# Altium schematic sheet ALU_Add_Shift.SchDoc
size B; Author: E. Sims; Organization: Let's Build Rockets Inc.; SheetNumber: 1; SheetTotal: 3
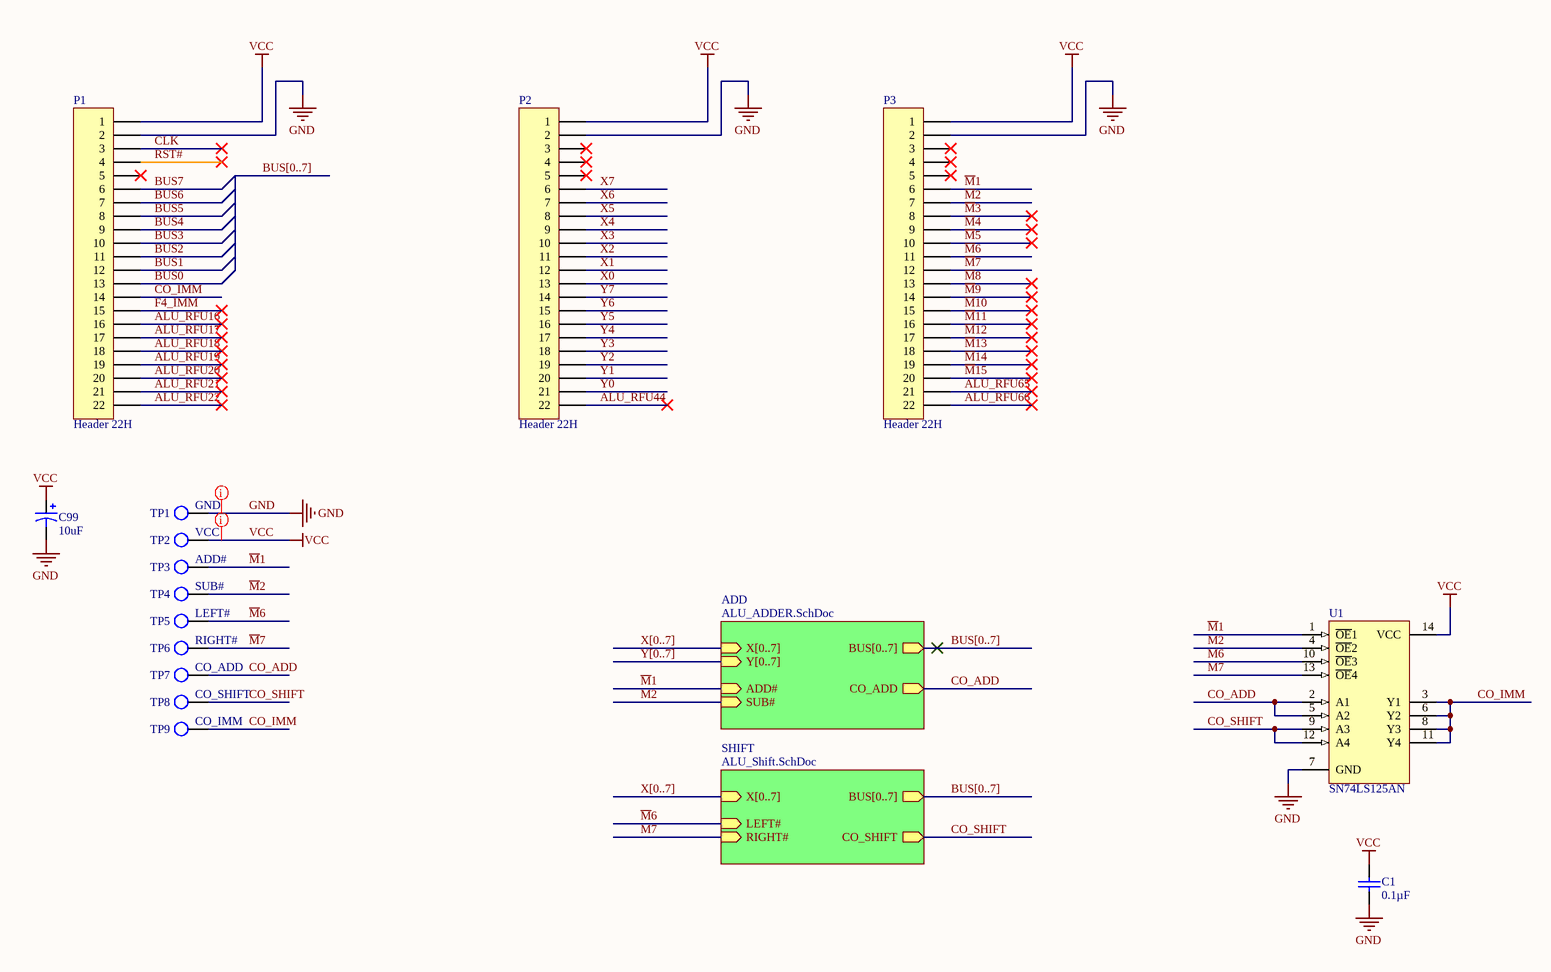
[diagram p0: ALU_Add_Shift.SchDoc]

## Parts
C1  Capacitance: 0.1µF  [VISH-K104K15X7RF5TL2]  (hidden comment: K104K15X7RF5TL2)
C99  value 10uF  [C5x7]  (hidden comment: Cap Pol5)
P1  Header 22H  [HDR1X22H]
P2  Header 22H  [HDR1X22H]
P3  Header 22H  [HDR1X22H]
TP1  GND  [KSTN-5011_V]  (no BOM)
TP2  VCC  [KSTN-5011_V]  (no BOM)
TP3  ADD#  [KSTN-5011_V]  (no BOM)
TP4  SUB#  [KSTN-5011_V]  (no BOM)
TP5  LEFT#  [KSTN-5011_V]  (no BOM)
TP6  RIGHT#  [KSTN-5011_V]  (no BOM)
TP7  CO_ADD  [KSTN-5011_V]  (no BOM)
TP8  CO_SHIFT  [KSTN-5011_V]  (no BOM)
TP9  CO_IMM  [KSTN-5011_V]  (no BOM)
U1  SN74LS125AN  [N014]

## Sub-sheets
ADD = ALU_ADDER.SchDoc: X[0..7] (in), BUS[0..7] (out), CO_ADD (out), SUB# (in), ADD# (in), Y[0..7] (in)
SHIFT = ALU_Shift.SchDoc: X[0..7] (in), BUS[0..7] (out), CO_SHIFT (out), RIGHT# (in), LEFT# (in)

## Nets
GND: C1.2 C99.2 P1.2 P2.2 P3.2 TP1.1 U1.7(GND)
VCC: C1.1 C99.1 P1.1 P2.1 P3.1 TP2.1 U1.14(VCC)
ALU_RFU16: P1.16
ALU_RFU17: P1.17
ALU_RFU18: P1.18
ALU_RFU19: P1.19
ALU_RFU20: P1.20
ALU_RFU21: P1.21
ALU_RFU22: P1.22
ALU_RFU44: P2.22
ALU_RFU65: P3.21
ALU_RFU66: P3.22
BUS0: P1.13
BUS1: P1.12
BUS2: P1.11
BUS3: P1.10
BUS4: P1.9
BUS5: P1.8
BUS6: P1.7
BUS7: P1.6
CLK: P1.3
CO_ADD: TP7.1 U1.2(A1) U1.5(A2) ; sheet ADD/CO_ADD
CO_IMM: P1.14 TP9.1 U1.3(Y1) U1.6(Y2) U1.8(Y3) U1.11(Y4)
CO_SHIFT: TP8.1 U1.9(A3) U1.12(A4) ; sheet SHIFT/CO_SHIFT
F4_IMM: P1.15
~{M}1: P3.6 TP3.1 U1.1(~{OE}1) ; sheet ADD/ADD#
~{M}2: P3.7 TP4.1 U1.4(~{OE}2) ; sheet ADD/SUB#
~{M}3: P3.8
~{M}4: P3.9
~{M}5: P3.10
~{M}6: P3.11 TP5.1 U1.10(~{OE}3) ; sheet SHIFT/LEFT#
~{M}7: P3.12 TP6.1 U1.13(~{OE}4) ; sheet SHIFT/RIGHT#
~{M}8: P3.13
~{M}9: P3.14
~{M}10: P3.15
~{M}11: P3.16
~{M}12: P3.17
~{M}13: P3.18
~{M}14: P3.19
~{M}15: P3.20
RST#: P1.4
X0: P2.13
X1: P2.12
X2: P2.11
X3: P2.10
X4: P2.9
X5: P2.8
X6: P2.7
X7: P2.6
Y0: P2.21
Y1: P2.20
Y2: P2.19
Y3: P2.18
Y4: P2.17
Y5: P2.16
Y6: P2.15
Y7: P2.14

Not connected (* = marked no-connect by the designer): P1 5*; P2 3* 4* 5*; P3 3* 4* 5*

## Buses and harness runs
bus BUS[0..7]
bus BUS[0..7] = sheet ADD/BUS[0..7]
bus BUS[0..7] = sheet SHIFT/BUS[0..7]
bus X[0..7] = sheet ADD/X[0..7]
bus X[0..7] = sheet SHIFT/X[0..7]
bus Y[0..7] = sheet ADD/Y[0..7]

## Layout directives
rule Width Constraint [Pref Width = 20mil    Min Width = 20mil    Max Width = 50mil]; rule Routing Via Style [Pref Size = 35mil    Pref Hole Size = 20mil]; net class PWR: GND, VCC

## Notes on the sheet
- Let's Build Rocket's Inc. Modular Paylaod System Based on TMP-010 Rev
  For more information visit https://github.com/LetsBuildRockets/Modular-Payload-System
  This work is licensed under CC BY-NC 4.0. To view a copy of this license, visit https://creativecommons.org/licenses/by-nc/4.0
- Title
- Size:
- Date:
- Assembly Variant:
- B
- Number:
- Time:
- Revision:
- Sheet
- of
- Author:
- File:

## Library data of the parts
C1 = CMP-2000-06508-1: Ceramic Capacitor, 100 nF, +/- 10%, 50 V, -55 to 125 degC, 2-Pin THD, RoHS, Tape and Reel; Manufacturer: Vishay; Other Names: BC1084CT; Catalog Drawings: Mono-KapSide2-15_5.58Mono-KapSide1_15; Temperature Coefficient: X7R; Voltage - Rated: 50V; Online Catalog: Mono-Kap™Series; Size / Dimension: 0.157"Lx0.098"W(4.00mmx2.50mm); Operating Temperature: -55°C~125°C; Family: CeramicCapacitors; Manufacturer URL: http://www.vishay.com/; Standard Package: 1; Thickness (Max): -; Ratings: -; Datasheet Version: 08/2013; Package Description: 2-Pin Through Hole Device, Body 4 x 2.6 mm; Mounting Type: ThroughHole; Features: -; Lead Spacing: 0.098"(2.50mm); Tolerance: ±10%; Category: Capacitors; Mounting Technology: ThroughHole; Lead Style: Straight; Datasheet URL: http://www.vishay.com/docs/45171/kseries.pdf; Applications: GeneralPurpose; Package / Case: Radial; Height - Seated (Max): 0.220"(5.58mm); Package Reference: K104K15X7RF5TL2; Series: Mono-Kap™K; Packaging: CutTape(CT)
C99 = Cap Pol5: Polarized Capacitor; Published: 8-Jun-2000; LatestRevisionDate: 17-Jul-2002; LatestRevisionNote: Re-released for DXP Platform.; PackageReference: POLAR0.8; Publisher: Altium Limited; PackageDescription: Polarized Capacitor; 2 Leads
P1-P3 = Header 22H: Header, 22-Pin, Right Angle; System: Connector; LatestRevisionDate: 17-Jul-2002; LatestRevisionNote: Re-released for DXP Platform.; Publisher: Altium Limited
TP1-TP9 = TP
U1 = SN74LS125AN: Quadruple Bus Buffer with 3-State Outputs; Published: 8-Jun-2000; LatestRevisionDate: 06-Jun-2005; LatestRevisionNote: Stylized 3D Model Added.; DatasheetVersion: Mar-1988; PackageVersion: Oct-1995; PackageReference: N014; Publisher: Altium Limited; PackageDescription: DIP; 14 Leads; Row Spacing 7.62 mm; Pitch 2.54 mm; ComponentLink1Description: Manufacturer Link; ComponentLink1URL: http://www.ti.com/; ComponentLink2Description: Datasheet; ComponentLink2URL: http://www-s.ti.com/sc/ds/sn74ls126a.pdf